# EAGLE design CAM-M8Q-Breakout_v10 (EAGLE 7.7.0)
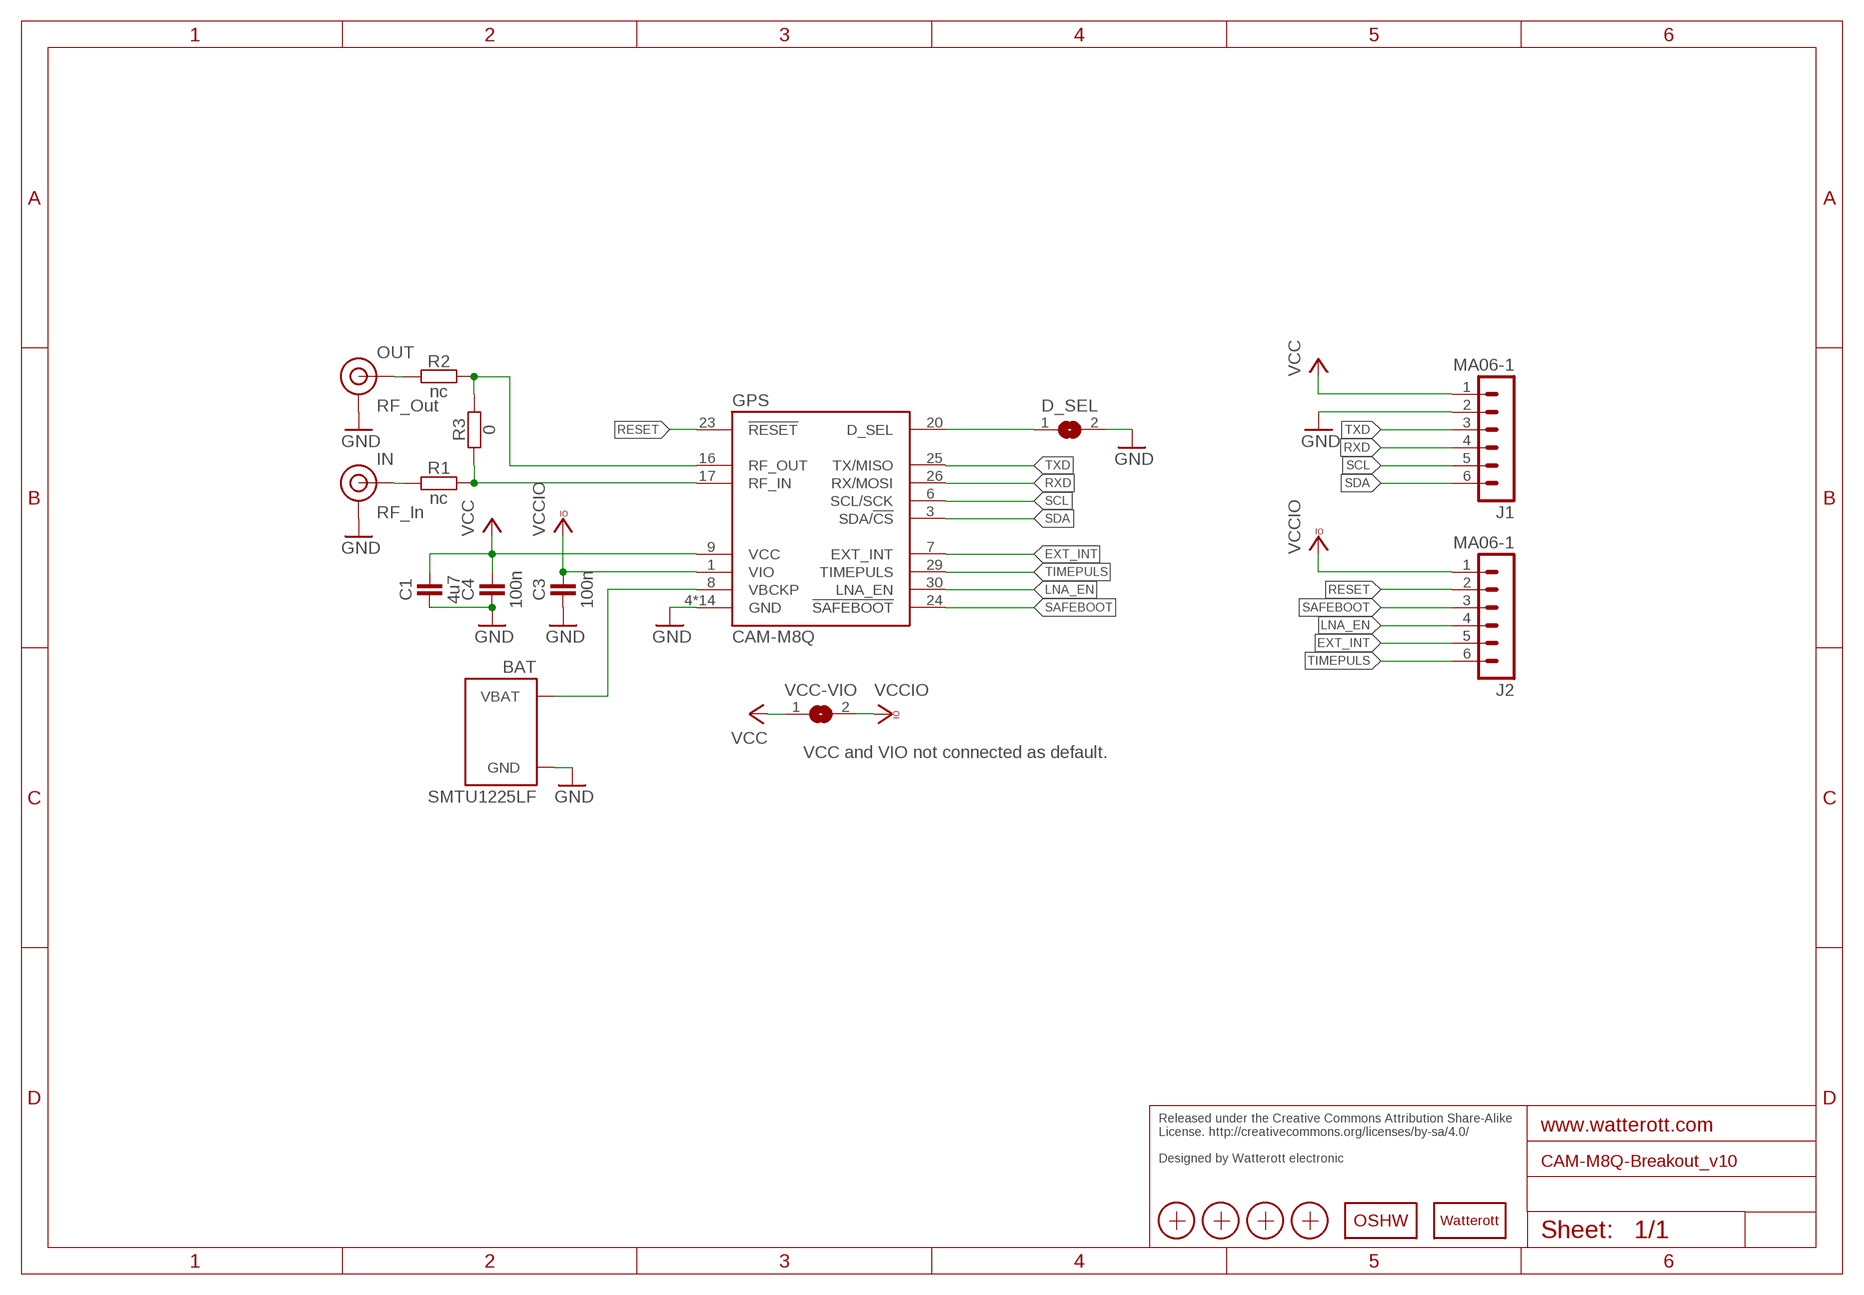
[diagram p0: schematic, sheet 1]

## Parts
BAT  SMTU1225LF  BATTERY-SMTU1225LF  [BAT-SMTU1225LF]
C1  4u7  CAPACITOR-0402  [C0402]
C3  100n  CAPACITOR-0402  [C0402]
C4  100n  CAPACITOR-0402  [C0402]
D_SEL  JUMPER2-0603-NC  [JUMPER2-0603_NC]
GPS  CAM-M8Q  [CAM-M8Q]
IN  RF_In  U.FL  [U.FL]
J1  MA06-1  [MA06-1]
J2  MA06-1  [MA06-1]
LOGO1  LOGO-S_PLACE_M  [SPARK_TPLACE_M]
LOGO2  OSHW_LOGOX0070  [OSHW_6X70]
OUT  RF_Out  U.FL  [U.FL]
R1  nc  RESISTOR-0402  [C0402]
R2  nc  RESISTOR-0402  [C0402]
R3  0  RESISTOR-0402  [C0402]
VCC-VIO  JUMPER2-0603-NC  [JUMPER2-0603_NC]
X1  PASSER-07  [PASSER_07MM]
X2  PASSER-07  [PASSER_07MM]
X3  PASSER-07  [PASSER_07MM]
X4  PASSER-07  [PASSER_07MM]

## Nets
D_SEL: D_SEL.1 GPS.20(D_SEL)
EXT_INT: GPS.7(EXT_INT) J2.5
GND: BAT.-(GND) C1.1 C3.1 C4.1 D_SEL.2 GPS.4(GND) GPS.5(GND) GPS.10(GND) GPS.11(GND) GPS.12(GND) GPS.13(GND) GPS.14(GND) GPS.15(GND) GPS.18(GND) GPS.19(GND) GPS.21(GND) GPS.22(GND) GPS.27(GND) GPS.31(GND) IN.1(GND) IN.2(GND) J1.2 OUT.1(GND) OUT.2(GND)
IN: IN.FEED(SIGNAL) R1.1
LNA_EN: GPS.30(LNA_EN) J2.4
OUT: OUT.FEED(SIGNAL) R2.1
RESET: GPS.23(!RESET) J2.2
RFIN: GPS.17(RF_IN) R1.2 R3.1
RFOUT: GPS.16(RF_OUT) R2.2 R3.2
RXD: GPS.26(RX/MOSI) J1.4
SAFEBOOT: GPS.24(!SAFEBOOT) J2.3
SCL: GPS.6(SCL/SCK) J1.5
SDA: GPS.3(SDA/!CS) J1.6
TIMEPULS: GPS.29(TIMEPULS) J2.6
TXD: GPS.25(TX/MISO) J1.3
VBCKP: BAT.+(VBAT) GPS.8(VBCKP)
VCC: C1.2 C4.2 GPS.9(VCC) J1.1 VCC-VIO.1
VIO: C3.2 GPS.1(VIO) J2.1 VCC-VIO.2 ; supply symbol labelled VCCIO

## Notes on the sheet
- VCC and VIO not connected as default.
- Released under the Creative Commons Attribution Share-Alike 
  License. http://creativecommons.org/licenses/by-sa/4.0/
  
  Designed by Watterott electronic

## Library data of the parts
BAT = we-power:BATTERY: Battery Holder
C1 C3 C4 = we-rcl:CAPACITOR: Capacitors ...2.2uF @ 6.3V -> 0402 ...4.7uF @ 6.3V -> 0603 ...10uF @ 16V -> 0805 ...22uF @ 25V -> 1206
D_SEL VCC-VIO = we-rcl:JUMPER2: 2 Pin Jumpers
GPS = we-sensor:CAM-M8Q: u-blox CAM-M8Q Multi-GNSS-Antennenmodule
IN OUT = we-con:U.FL: U.FL Connector
J1 J2 = we-con:MA06-1: Pin Header
LOGO1 = we-symbol:LOGO: Watterott electronic Logo
LOGO2 = we-symbol:OSHW_LOGO: Open-Source-Hardware Logo
R1-R3 = we-rcl:RESISTOR: Resistors all kinds in 0402 and 0603
X1-X4 = we-symbol:PASSER: Fiducial Markers

## Board
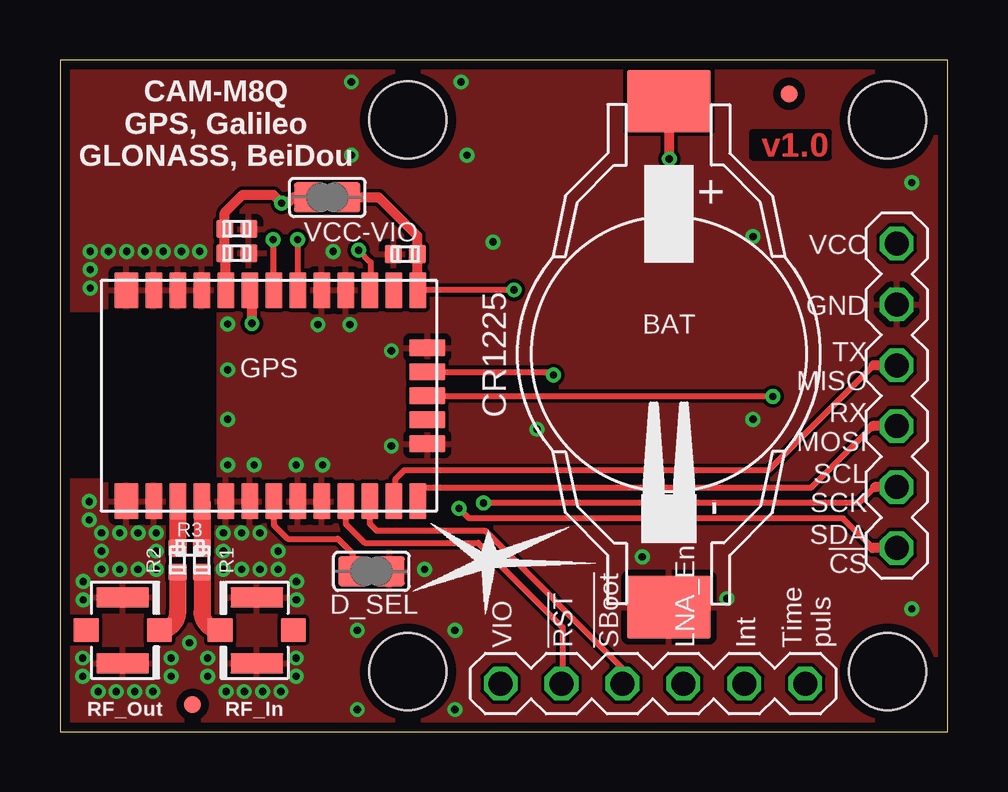
[diagram p1: board, top side]
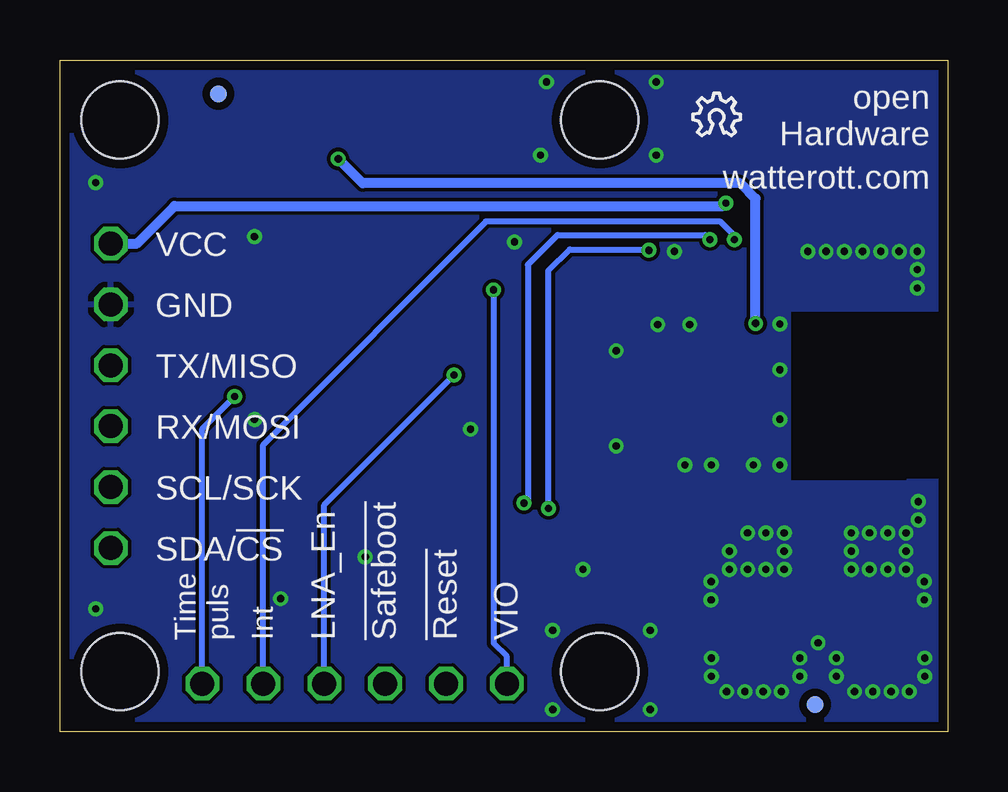
[diagram p2: board, bottom side, seen from below]

Size 37 x 28 mm. Coordinates in mm from the lower left corner, seen from the top.
Outline: 0,0 37,0 37,28 0,28 0,0
Copper layers (1*16): Top 0.035mm / dielectric 1.5mm / Bottom 0.035mm
Design rules "we-dru-2-layer": minimum track width 0.15mm, minimum drill 0.3mm, track to track 0.15mm, track to pad 0.15mm, pad to pad 0.15mm, via to via 0.15mm, smd to smd 0.1mm, copper to edge 0.4mm, drill to drill 0.2mm, minimum pad ring 0.18mm, minimum via ring 0.16mm, stop-mask expansion 0.1mm, vias tented up to drill 0.5mm, thermal gap 0.25mm
Holes 3.2 mm at 14.5,2.5 14.5,25.5 34.5,25.5 34.5,2.5
tRestrict: area 0.3,10.7 to 6.3,17.4
bRestrict: area 0.3,10.7 to 6.3,17.4

### Footprints (pad centres in the part's own frame; a part is rotated, then mirrored left to right if it is on the bottom)
BAT-SMTU1225LF = smd 3.5 x 2.6: + 0,10.55; - 0,-10.55
C0402 = smd 0.75 x 0.7: 1 0,0.5; 2 0,-0.5
JUMPER2-0603_NC = smd 1.25 x 1.25: 1 0,0.76; 2 0,-0.76
CAM-M8Q = smd 0.7 x 1.5: 1 -6.2,-4.4; 2 -5.2,-4.4; 3 -4.2,-4.4; 4 -3.2,-4.4; 5 -2.2,-4.4; 6 -1.2,-4.4; 7 -0.2,-4.4; 8 0.8,-4.4; 9 1.8,-4.4; 10 2.8,-4.4; 11 3.8,-4.4; 12 4.8,-4.4; 15 4.8,4.4; 16 3.8,4.4; 17 2.8,4.4; 18 1.8,4.4; 19 0.8,4.4; 20 -0.2,4.4; 21 -1.2,4.4; 22 -2.2,4.4; 23 -3.2,4.4; 24 -4.2,4.4; 25 -5.2,4.4; 26 -6.2,4.4 | smd 1 x 1.5: 13 5.95,-4.4; 14 5.95,4.4 | smd 1.5 x 0.7: 27 -6.6,2; 28 -6.6,1; 29 -6.6,0; 30 -6.6,-1; 31 -6.6,-2
U.FL = smd 2.2 x 0.85: 1 0,1.375; 2 0,-1.375 | smd 1.05 x 1: FEED 1.525,0; NC -1.525,0
MA06-1 = drill 1 octagon: 1 0,6.35; 2 0,3.81; 3 0,1.27; 4 0,-1.27; 5 0,-3.81; 6 0,-6.35
PASSER_07MM = smd 0.7 x 0.7: X 0,0

### Placement (x,y rotation side)
BAT  25.38,15.73 0 top
C1  7.37,20.95 270 top
C3  14.4,19.91 90 top
C4  7.37,19.94 270 top
D_SEL  12.99,6.68 90 top
GPS  8.71,14 180 top
IN  8.21,4.22 180 top
J1  34.88,14 0 top
J2  24.72,2 90 top
LOGO1  17.91,7.11 0 top
LOGO2  10.62,24.84 0 bottom
OUT  2.62,4.22 0 top
R1  5.92,7.14 180 top
R2  4.91,7.14 180 top
R3  5.41,7.65 270 top
VCC-VIO  11.14,22.27 90 top
X1  30.4,26.59 0 top
X2  5.52,1.13 0 top
X3  5.52,1.13 0 bottom
X4  30.4,26.59 0 bottom

### Tracks (layer width: path | path; a pad name or v marks a point on that pad's centre or on a via)
D_SEL
  Top 0.254: GPS.20 8.91,8.61 9.49,8.03 11.59,8.03 12.19,7.43 12.19,6.72 D_SEL.1
EXT_INT  (via drill 0.3)
  Top 0.254: GPS.7 8.91,20.48 v8.89,20.51
  Bottom 0.254: J2.5 28.53,11.95 19.21,21.27 | 19.24,21.27 19.21,21.27 | 19.21,21.27 9.49,21.27 8.89,20.67 v8.89,20.51
GND  (via drill 0.3)
  other vias: 2.49,8.29 3.25,8.29 4.02,8.29 4.02,7.52 4.02,6.76 3.25,6.76 2.49,6.76 1.73,6.76 1.73,7.52 1.73,8.29 6.81,8.29 6.81,7.52 6.81,6.76 7.57,6.76 8.33,6.76 9.1,6.76 9.1,7.52 8.33,8.29 7.57,8.29 4.64,3.06 6.16,3.06 5.4,3.7 4.64,2.3 3.87,1.67 3.11,1.67 2.35,1.67 1.59,1.67 0.95,2.3 0.95,3.06 0.97,6.25 0.97,5.49 9.86,6.25 9.86,5.49 6.16,2.3 6.92,1.67 7.68,1.67 8.45,1.67 9.21,1.67 9.84,2.3 9.84,3.06 10.95,11.11 13.81,11.91 13.81,15.88 12.08,16.97 10.75,16.97 24.27,7.29 5.83,20.02 5.07,20.02 4.3,20.02 3.54,20.02 2.78,20.02 2.02,20.02 11.38,20.02 1.25,20.02 1.25,19.26 1.25,18.49 1.22,8.82 1.22,9.59 15.19,6.76 28.89,20.64 28.89,13.02 19.89,12.6 18.05,20.41 16.97,24.03 16.72,27.08 12.14,27.08 12.14,24.03 35.51,5.11 9.84,11.11 8.1,11.11 6.99,11.11 35.51,22.89 12.4,0.92 16.46,0.92 16.46,4.22 12.4,4.22 27.8,5.54 6.99,16.99 6.99,13.02 6.99,15.08
  pour Bottom: 0,0 37,0 37,28 0,28
  pour Top: 0,0 37,0 37,28 0,28
IN
  Top 0.7: R1.1 5.92,4.98 arc90 IN.FEED
LNA_EN  (via drill 0.3)
  Top 0.254: GPS.30 20.43,15 v20.57,14.86
  Bottom 0.254: J2.4 25.99,9.45 v20.57,14.86
OUT
  Top 0.7: R2.1 4.91,4.98 arc-90 OUT.FEED
RESET
  Top 0.254: GPS.23 11.91,8.66 12.7,7.87 17.43,7.87 20.95,4.35 20.95,2.05 J2.2
RFIN
  Top 0.254: R1.2 R3.1
  Top 0.61: GPS.17
  Top 0.7: GPS.17 R1.2
RFOUT
  Top 0.254: R2.2 R3.2
  Top 0.61: GPS.16
  Top 0.7: GPS.16 R3.2
RXD
  Top 0.254: 33.88,12.73 31.3,10.16 14.99,10.16 14.99,9.67 GPS.26
  Top 0.406: J1.4 33.88,12.73
SAFEBOOT
  Top 0.254: GPS.24 12.91,8.68 13.21,8.38 17.72,8.38 23.5,2.6 23.5,2.05 J2.3
SCL  (via drill 0.3)
  Top 0.254: 33.97,10.19 33.31,9.53 v17.65,9.53 | v9.91,20.51 GPS.6
  Top 0.406: J1.5 33.97,10.19
  Bottom 0.254: v9.91,20.51 10.1,20.7 16.26,20.7 17.49,19.46 17.49,9.68 v17.65,9.53
SDA  (via drill 0.3)
  Top 0.254: 33.88,7.65 32.64,8.89 17.05,8.89 v16.64,9.3 | v12.45,20.07 12.95,19.56 12.95,18.44 GPS.3
  Top 0.406: J1.6 33.88,7.65
  Bottom 0.254: v16.64,9.3 16.64,19.21 15.75,20.1 12.48,20.1 v12.45,20.07
TIMEPULS  (via drill 0.3)
  Top 0.254: GPS.29 29.69,14 v29.72,13.97
  Bottom 0.254: J2.6 31.07,12.62 v29.72,13.97
TXD
  Top 0.254: 33.91,15.27 29.53,10.89 14.35,10.89 13.97,10.51 13.97,9.65 GPS.25
  Top 0.406: J1.3 33.91,15.27
VBCKP  (via drill 0.3)
  Top 0.406: v8,17.02 8,18.31 GPS.8 | v25.4,23.88 25.4,26.27 BAT.+
  Bottom 0.406: v8,17.02 8,22.23 8.64,22.86 24.38,22.86 v25.4,23.88
VCC  (via drill 0.3)
  Top 0.406: GPS.9 6.92,19.89 arc90 C4.2 C1.2 6.87,21.63 7.62,22.38 8.89,22.38 v9.24,22.04 9.27,22.07 9.53,22.07 9.73,22.27 VCC-VIO.1
  Bottom 0.406: J1.1 33.78,20.35 32.23,21.91 9.37,21.91 v9.24,22.04
VIO  (via drill 0.3)
  Top 0.254: v18.92,18.41 14.93,18.41
  Top 0.406: VCC-VIO.2 13.29,22.27 14.9,20.66 C3.2 14.91,19.89 GPS.1 14.93,18.41
  Bottom 0.254: J2.1 18.37,3.13 18.92,3.68 v18.92,18.41

### Text on the board
Top: v1.0
tPlace: CAM-M8Q / GPS, Galileo / GLONASS, BeiDou | VCC | GND | CR1225 | TX / MISO | RX / MOSI | SCL / SCK | SDA / !CS | VIO | !RST | !SBoot | LNA_En | Int | Time / puls
bPlace: open / Hardware | watterott.com | VCC | GND | TX/MISO | RX/MOSI | SCL/SCK | SDA/!CS | VIO | !Reset | !Safeboot | LNA_En | Int | Time / puls
Reference: Silkscreen: 21 tPlace + 22 bPlace